# EAGLE design DUALLM13700VCA v2 (EAGLE 9.6.2)
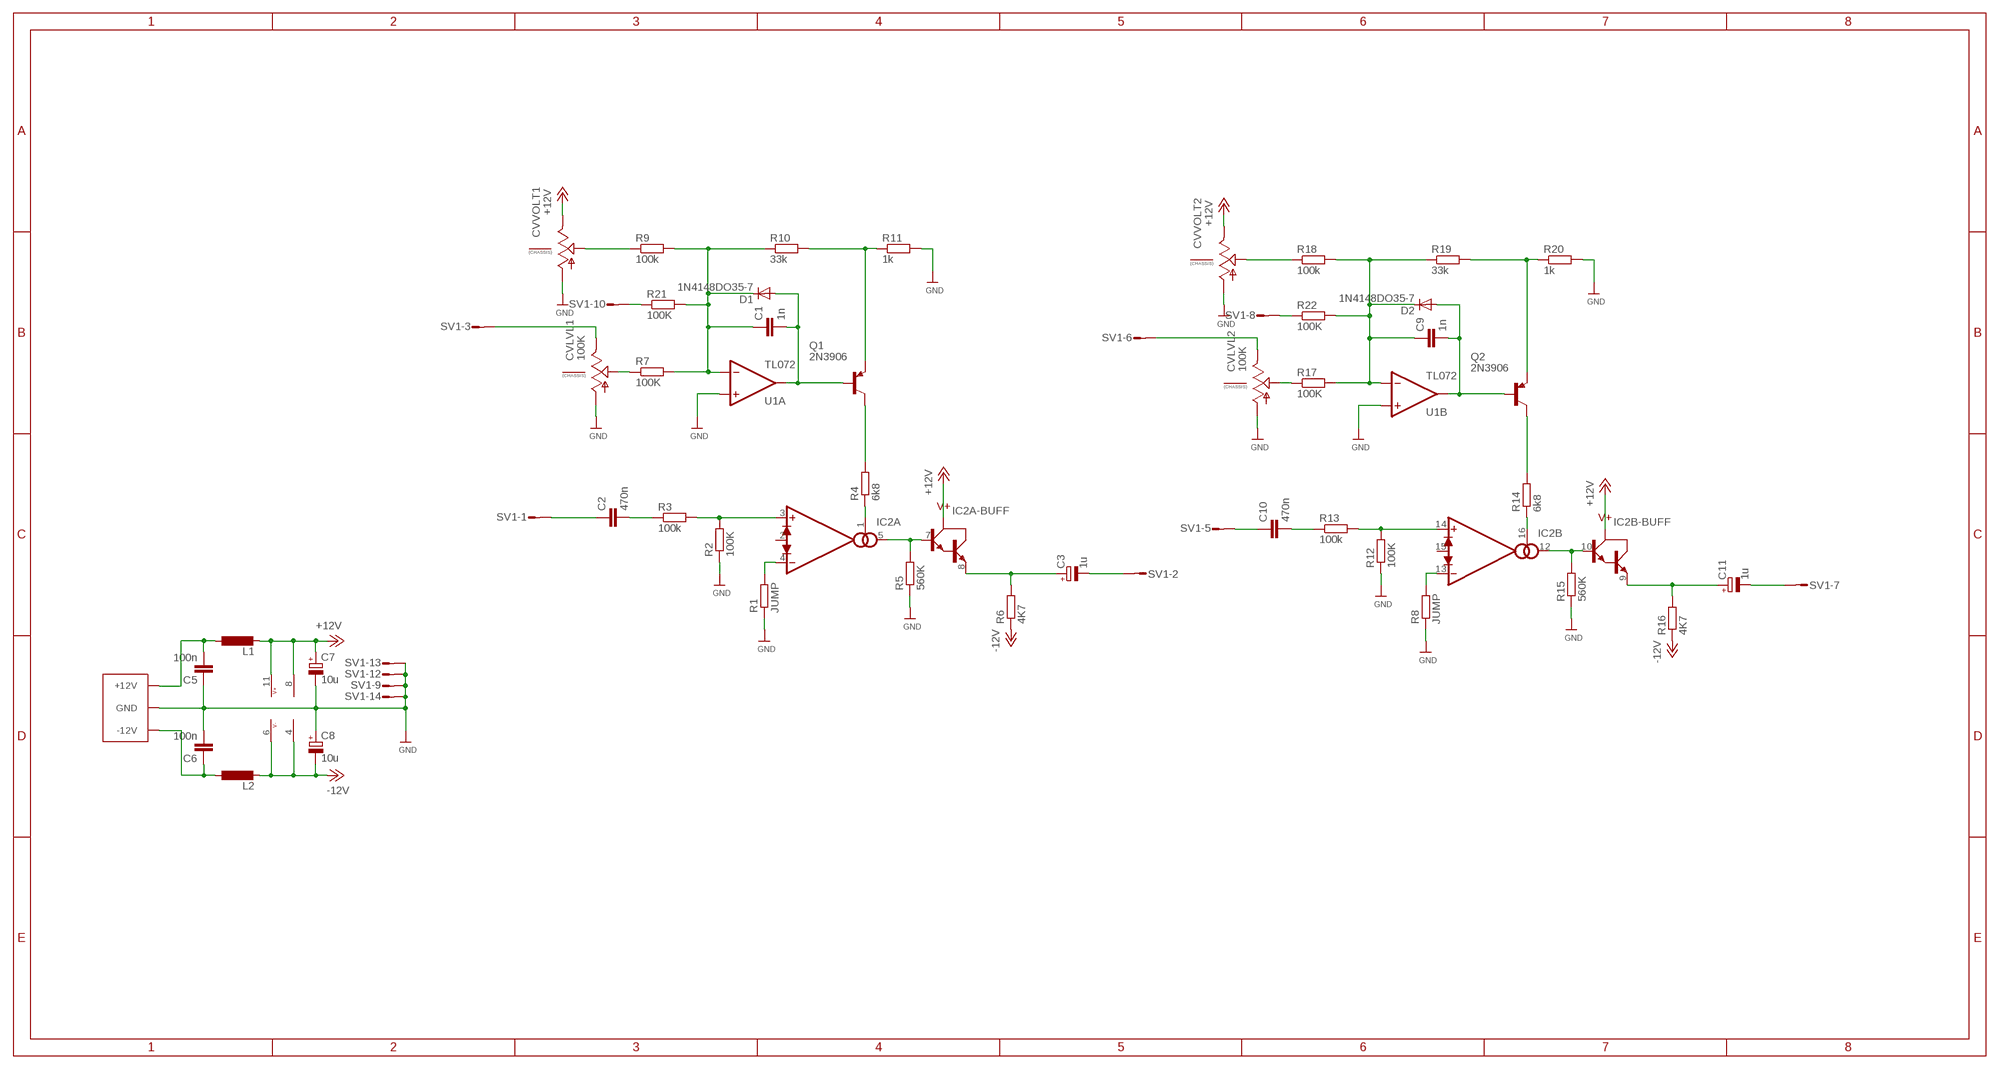
[diagram p0: schematic, sheet 1]

## Parts
C1  1n  C-EU050-025X075  [C050-025X075]
C2  470n  C-EU050-025X075  [C050-025X075]
C3  1u  CPOL-EUE2-4  [E2-4]
C4  EURO_POWER_LOCKSKINNY  [EURO_POWER_HEADER]
C5  100n  C-EU050-025X075  [C050-025X075]
C6  100n  C-EU050-025X075  [C050-025X075]
C7  10u  CPOL-EUE2-4  [E2-4]
C8  10u  CPOL-EUE2-4  [E2-4]
C9  1n  C-EU050-025X075  [C050-025X075]
C10  470n  C-EU050-025X075  [C050-025X075]
C11  1u  CPOL-EUE2-4  [E2-4]
CVLVL1  100K  9MM_SNAP-IN_POT_CHASSIS  [9MM_SNAP-IN_POT]
CVLVL2  100K  9MM_SNAP-IN_POT_CHASSIS  [9MM_SNAP-IN_POT]
CVVOLT1  9MM_SNAP-IN_POT_CHASSIS  [9MM_SNAP-IN_POT]
CVVOLT2  9MM_SNAP-IN_POT_CHASSIS  [9MM_SNAP-IN_POT]
D1  1N4148DO35-7  [DO35-7]
D2  1N4148DO35-7  [DO35-7]
IC2  LM13700N  [DIL16]
L1  L-EUIR-4  [IR-4]
L2  L-EUIR-4  [IR-4]
Q1  2N3906  [TO92]
Q2  2N3906  [TO92]
R1  JUMP  R-EU_0207/7  [0207/7]
R2  100K  R-EU_0207/7  [0207/7]
R3  100k  R-EU_0207/7  [0207/7]
R4  6k8  R-EU_0207/7  [0207/7]
R5  560K  R-EU_0207/7  [0207/7]
R6  4K7  R-EU_0207/7  [0207/7]
R7  100K  R-EU_0207/7  [0207/7]
R8  JUMP  R-EU_0207/7  [0207/7]
R9  100k  R-EU_0207/7  [0207/7]
R10  33k  R-EU_0207/7  [0207/7]
R11  1k  R-EU_0207/7  [0207/7]
R12  100K  R-EU_0207/7  [0207/7]
R13  100k  R-EU_0207/7  [0207/7]
R14  6k8  R-EU_0207/7  [0207/7]
R15  560K  R-EU_0207/7  [0207/7]
R16  4K7  R-EU_0207/7  [0207/7]
R17  100K  R-EU_0207/7  [0207/7]
R18  100k  R-EU_0207/7  [0207/7]
R19  33k  R-EU_0207/7  [0207/7]
R20  1k  R-EU_0207/7  [0207/7]
R21  100K  R-EU_0207/7  [0207/7]
R22  100K  R-EU_0207/7  [0207/7]
SV1  S14P  [S14P]
U1  TL072  [DIL08-SML]

## Nets
+12V: C7.+ CVVOLT1.3(E) CVVOLT2.3(E) IC2.11(PWR:V+) L1.2 U1.8(P:V+)
-12V: C8.- IC2.6(PWR:V-) L2.2 R6.1 R16.1 U1.4(P:V-)
GND: C4.3(GND) C4.4(GND) C4.5(GND) C4.6(GND) C4.7(GND) C4.8(GND) C5.1 C6.2 C7.- C8.+ CVLVL1.1(A) CVLVL2.1(A) CVVOLT1.1(A) CVVOLT2.1(A) R1.1 R2.1 R5.1 R8.1 R11.2 R12.1 R15.1 R20.2 SV1.9 SV1.12 SV1.13 SV1.14 U1.3(A:+IN) U1.5(B:+IN)
N$1: IC2.3(A:+IN) R2.2 R3.2
N$2: IC2.4(A:-IN) R1.2
N$3: CVVOLT1.2(S) R9.1
N$4: C2.2 R3.1
N$5: Q1.1(C) R4.2
N$6: IC2.1(A:BIAS) R4.1
N$7: C1.2 D1.A Q1.2(B) U1.1(A:OUT)
N$8: C1.1 D1.C R7.2 R9.2 R10.1 R21.2 U1.2(A:-IN)
N$9: Q1.3(E) R10.2 R11.1
N$10: CVLVL1.2(S) R7.1
N$11: CVLVL1.3(E) SV1.3
N$12: IC2.5(A:OUT) IC2.7(A-BUFF:IN) R5.2
N$13: C4.9(+12V) C4.10(+12V) C5.2 L1.1
N$14: C3.+ IC2.8(A-BUFF:OUT) R6.2
N$15: C3.- SV1.2
N$16: C4.1(-12V) C4.2(-12V) C6.1 L2.1
N$17: C2.1 SV1.1
N$18: IC2.14(B:+IN) R12.2 R13.2
N$19: Q2.1(C) R14.2
N$20: IC2.16(B:BIAS) R14.1
N$21: C9.2 D2.A Q2.2(B) U1.7(B:OUT)
N$22: C9.1 D2.C R17.2 R18.2 R19.1 R22.2 U1.6(B:-IN)
N$23: Q2.3(E) R19.2 R20.1
N$24: CVVOLT2.2(S) R18.1
N$25: CVLVL2.2(S) R17.1
N$26: CVLVL2.3(E) SV1.6
N$27: IC2.10(B-BUFF:IN) IC2.12(B:OUT) R15.2
N$28: C11.+ IC2.9(B-BUFF:OUT) R16.2
N$29: C11.- SV1.7
N$30: IC2.13(B:-IN) R8.2
N$31: C10.2 R13.1
N$32: C10.1 SV1.5
N$33: R21.1 SV1.10
N$34: R22.1 SV1.8
Unconnected: CVLVL1.CHASSIS1 CVLVL1.CHASSIS2 CVLVL2.CHASSIS1 CVLVL2.CHASSIS2 CVVOLT1.CHASSIS1 CVVOLT1.CHASSIS2 CVVOLT2.CHASSIS1 CVVOLT2.CHASSIS2 IC2.2(A:D-IN) IC2.15(B:D-IN) SV1.4 SV1.11

## Library data of the parts
C1 C2 C5 C6 C9 C10 = hexxxxrcl:C-EU: CAPACITOR, European symbol; SPICEPREFIX: C
C3 C7 C8 C11 = hexxxxrcl:CPOL-EU: POLARIZED CAPACITOR, European symbol; SPICEPREFIX: C
C4 = MusicThingModular:EURO_POWER_LOCK
CVLVL1 CVLVL2 CVVOLT1 CVVOLT2 = MusicThingModular:9MM_SNAP-IN_POT_CHASSIS: 9mm vertical snap-in pot, Alpha / Panasonic style, with a connection to the metal chassis for grounding
D1 D2 = diode:1N4148: DIODE high speed (Philips)
IC2 = skookumsynth_13700:LM13700: *UNVERIFIED* The LM13700 series consists of two current controlled transconductance amplifiers, each with differential inputs and a push-pull output. The two amplifiers share common supplies but otherwise operate independently. Linearizing diodes are provided at the inputs to reduce distortion and allow higher input levels. The result is a 10 dB signal-to-noise improvement referenced to 0.5 percent THD. High impedance buffers are provided which are especially designed to complement the dynamic range of the amplifiers. The output buffers of the LM13700 differ from those of the LM13600 in that their input bias currents (and hence their output DC levels) are independent of IABC. This may result in performance superior to that of the LM13600 in audio applications. MFG PART #s: DIL16: LM13700N/NOPB SO16:LM13700M/NOPB Datasheet: http://www.ti.com/lit/ds/symlink/lm13700.pdf
L1 L2 = rcl:L-EU: INDUCTOR, European symbol; SPICEPREFIX: L
Q1 Q2 = transistor-pnp:2N3906: PNP Transistor
R1-R22 = hexxxxrcl:R-EU_: RESISTOR, European symbol; SPICEPREFIX: R
SV1 = con-amp-mt:S14P: AMP MT CONNECTOR; OC_FARNELL: unknown; OC_NEWARK: unknown
U1 = MusicThingModular:TL072: Generic Dual Op Amp

## Net classes
0 default: width 0.61 mm

## Board
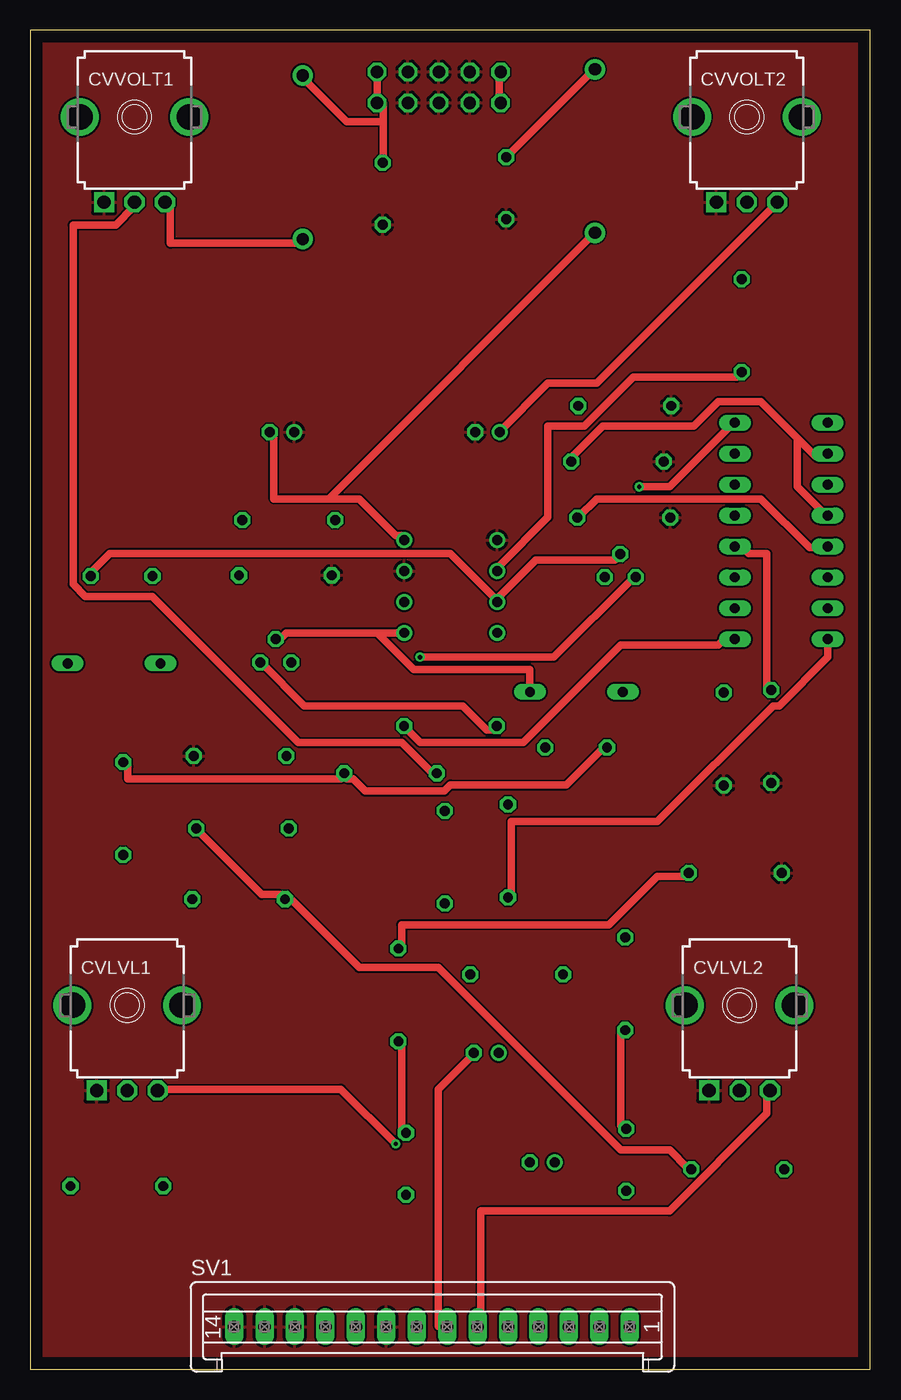
[diagram p1: board, top side]
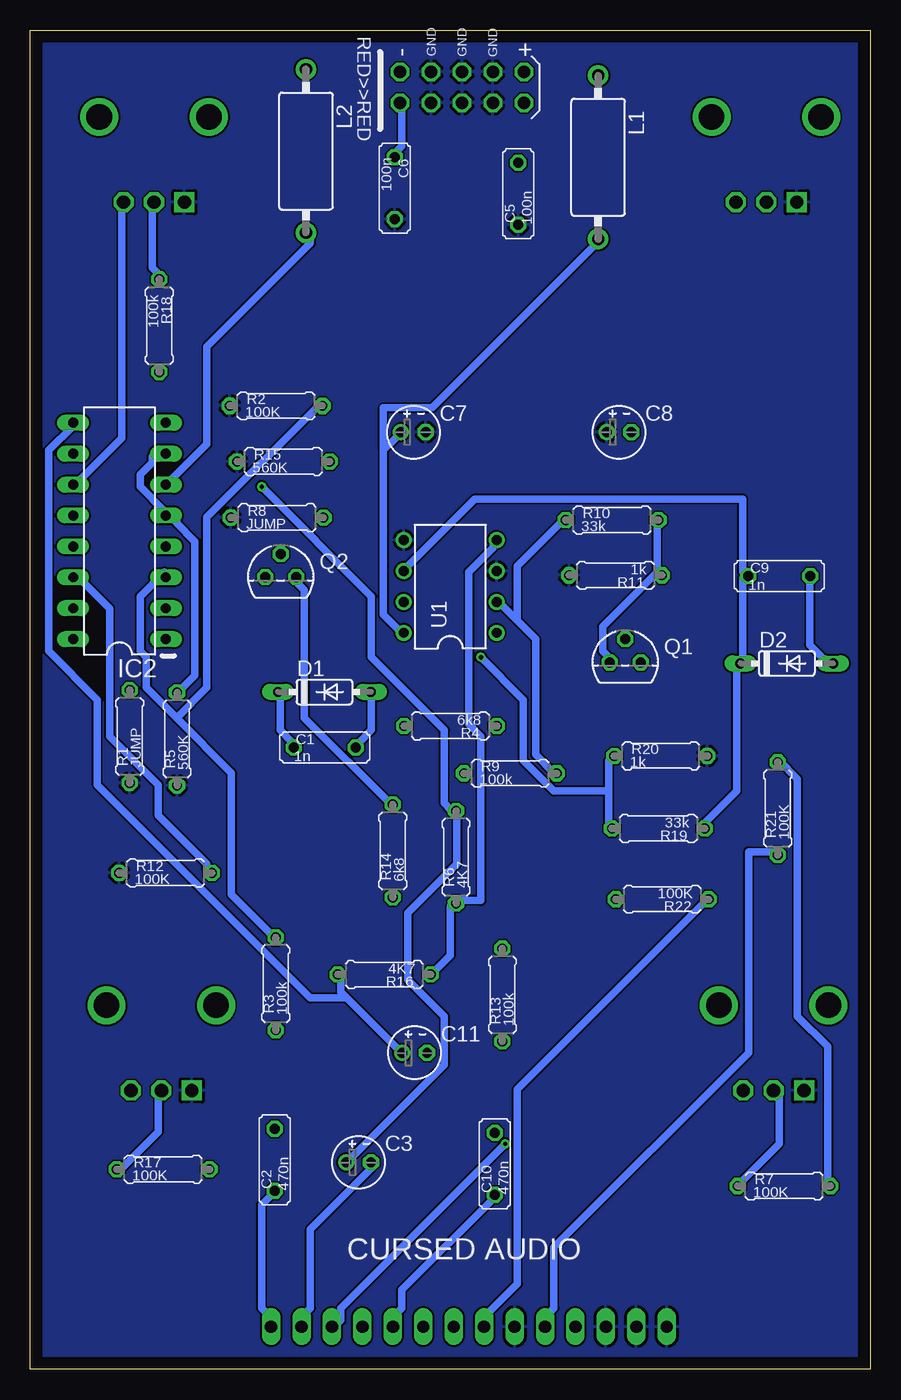
[diagram p2: board, bottom side, seen from below]

Size 69 x 110 mm. Coordinates in mm from the lower left corner, seen from the top.
Outline: 0,0 69,0 69,110 0,110 0,0
Copper layers (1*16): Top 0.035mm / dielectric 1.5mm / Bottom 0.035mm
Design rules "default": minimum track width 6mil, minimum drill 0.35mm, track to track 6mil, track to pad 6mil, pad to pad 6mil, via to via 6mil, smd to smd 6mil, copper to edge 40mil, drill to drill 6mil, minimum pad ring 10mil, minimum via ring 8mil, stop-mask expansion 4mil, vias tented up to drill 0mil, thermal gap 10mil

### Footprints (pad centres in the part's own frame; a part is rotated, then mirrored left to right if it is on the bottom)
C050-025X075 = drill 0.813 octagon: 1 -2.54,0; 2 2.54,0
E2-4 = drill 0.813 pad 1.27: + -1.016,0 | drill 0.813 pad 1.27 octagon: - 1.016,0
EURO_POWER_HEADER = drill 1.016 octagon: 1 -5.08,-1.27; 2 -5.08,1.27; 3 -2.54,-1.27; 4 -2.54,1.27; 5 0,-1.27; 6 0,1.27; 7 2.54,-1.27; 8 2.54,1.27; 9 5.08,-1.27; 10 5.08,1.27
9MM_SNAP-IN_POT = drill 1.1 square: 1 -2.5,-7 | drill 1.1 octagon: 2 0,-7; 3 2.5,-7 | drill 2.1 pad 2.794: CHASSIS1 -4.5,0; CHASSIS2 4.5,0
DO35-7 = drill 0.813 long: A 3.81,0; C -3.81,0
DIL16 = drill 0.813 long: 1 -8.89,-3.81; 2 -6.35,-3.81; 3 -3.81,-3.81; 4 -1.27,-3.81; 5 1.27,-3.81; 6 3.81,-3.81; 7 6.35,-3.81; 8 8.89,-3.81; 9 8.89,3.81; 10 6.35,3.81; 11 3.81,3.81; 12 1.27,3.81; 13 -1.27,3.81; 14 -3.81,3.81; 15 -6.35,3.81; 16 -8.89,3.81
IR-4 = drill 1 pad 1.676: 1 -6.705,0; 2 6.73,0
TO92 = drill 0.813 octagon: 1 1.27,0; 2 0,1.905; 3 -1.27,0
0207/7 = drill 0.813 octagon: 1 -3.81,0; 2 3.81,0
S14P = drill 1.016 long: 1 16.25,0; 2 13.75,0; 3 11.25,0; 4 8.75,0; 5 6.25,0; 6 3.75,0; 7 1.25,0; 8 -1.25,0; 9 -3.75,0; 10 -6.25,0; 11 -8.75,0; 12 -11.25,0; 13 -13.75,0; 14 -16.25,0
DIL08-SML = drill 0.813 pad 1.27: 1 -3.81,-3.81; 2 -1.27,-3.81; 3 1.27,-3.81; 4 3.81,-3.81; 5 3.81,3.81; 6 1.27,3.81; 7 -1.27,3.81; 8 -3.81,3.81

### Placement (x,y rotation side)
C1  44.82,51.07 0 bottom
C2  48.93,17.2 90 bottom
C3  42.04,16.99 0 bottom
C4  33.55,105.32 0 bottom
C5  28.93,96.58 90 bottom
C6  39.07,97.04 270 bottom
C7  37.55,76.99 0 bottom
C8  20.66,76.99 0 bottom
C9  7.49,65.15 0 bottom
C10  30.85,16.87 90 bottom
C11  37.44,25.99 0 bottom
CVLVL1  7.95,29.89 0 top
CVLVL2  58.25,29.89 0 top
CVVOLT1  8.55,102.89 0 top
CVVOLT2  58.85,102.89 0 top
D1  44.85,55.64 0 bottom
D2  6.87,57.99 0 bottom
IC2  61.68,68.87 90 bottom
L1  22.37,99.59 270 bottom
L2  46.37,100.1 270 bottom
Q1  20.14,58.07 0 bottom
Q2  48.44,65.07 0 bottom
R1  60.85,51.98 90 bottom
R2  48.82,79.15 0 bottom
R3  48.85,31.66 90 bottom
R4  34.5,52.85 180 bottom
R5  56.96,51.78 90 bottom
R6  34.04,42.06 90 bottom
R7  7.1,15.04 0 bottom
R8  48.74,69.96 0 bottom
R9  29.58,48.96 0 bottom
R10  21.22,69.77 0 bottom
R11  20.94,65.23 180 bottom
R12  57.9,40.77 0 bottom
R13  30.23,30.74 90 bottom
R14  39.23,42.58 90 bottom
R15  48.22,74.58 0 bottom
R16  39.94,32.42 180 bottom
R17  58.1,16.42 0 bottom
R18  58.42,85.74 270 bottom
R19  17.42,44.42 180 bottom
R20  17.22,50.39 0 bottom
R21  7.61,46.06 90 bottom
R22  17.1,38.61 180 bottom
SV1  32.98,3.48 0 top
U1  34.52,64.31 90 bottom

### Tracks (layer width: path | path; a pad name or v marks a point on that pad's centre or on a via)
+12V
  Top 0.61: CVVOLT1.3 11.5,95.5 11.5,92.5 22,92.5 L1.2 | CVVOLT2.3 61,95.5 46.5,81 42.5,81 38.5,77 C7.+
  Bottom 0.61: IC2.11 65,73 61.5,76.5 61.5,95.5 CVVOLT2.3 | 40,75.5 40,62 38.5,60.5 U1.8 | 40,75.5 39,76.5 C7.+ | 40,75.5 40,79 36,79 22.5,92.5 L1.2
-12V
  Top 0.61: 24.5,71.5 27,71.5 30,68.5 30.5,68.5 U1.4 | 24.5,71.5 20,71.5 20,76.5 C8.- | 24.5,71.5 L2.2
  Bottom 0.61: IC2.6 57.5,73 54.5,76 54.5,84 46,92.5 46,93 L2.2 | R16.1 36,32.5 34.5,34 34.5,38 R6.1 34,38.5 32,38.5 32,52 33,53 33,65.5 31,67.5 31,68 U1.4
GND
  pour Bottom: -1,114 71,114 71,-2 -1,-2
  pour Top: -2,114 73,114 73,-6 -2,-6
N$1
  Bottom 0.61: 57,53.5 59.5,56 59.5,58.5 60,59 60,63.5 58,65.5 IC2.3 | 57,53.5 52.5,49 52.5,39 49,35.5 R3.2 | 57,53.5 54.5,56 54.5,70 45.5,79 R2.2
N$2
  Top 0.61: R1.2 60.5,56 60.5,67 59,67 58.5,67.5 58,67.5 IC2.4
N$3
  Top 0.61: R9.1 33,49 30.5,51.5 22,51.5 10,63.5 4.5,63.5 3.5,64.5 3.5,94 7,94 8.5,95.5 CVVOLT1.2
N$4
  Top 0.61: R3.1 48.5,27.5 48.5,20 C2.2
N$5
  Top 0.61: Q1.1 19,58 22.5,54.5 35.5,54.5 37.5,52.5 38,52.5 R4.2
N$6
  Top 0.61: R4.1 31,52.5 32,51.5 40.5,51.5 48.5,59.5 56.5,59.5 57,60 57.5,60 IC2.1
N$7
  Top 0.61: U1.1 28.5,60.5 | 28.5,60.5 21,60.5 20.5,60 Q1.2 | 28.5,60.5 31.5,57.5 41,57.5 41,56 D1.A
  Bottom 0.61: C1.2 42,51.5 41,52.5 41,55.5 D1.A
N$8
  Top 0.61: C1.1 47,51 44,48 34.5,48 34,47.5 27.5,47.5 26.5,48.5 26,48.5 R9.2 25.5,48.5 8,48.5 8,49.5 R21.2
  Bottom 0.61: R7.2 3.5,15.5 3.5,26.5 6,29 6,48.5 7.5,50 R21.2 | C1.1 47.5,51.5 48.5,52.5 48.5,55.5 D1.C | 29,61.5 30.5,63 U1.2 | 29,61.5 27.5,60 27.5,50.5 26,49 R9.2 | 29,61.5 29,66 25.5,69.5 R10.1
N$9
  Bottom 0.61: 17.5,65.5 22,61 22,59 21.5,58.5 Q1.3 | 17.5,65.5 17.5,69.5 R10.2 | 17.5,65.5 R11.1
N$10
  Bottom 0.61: R7.1 10.5,15.5 7.5,18.5 7.5,22.5 CVLVL1.2
N$11  (via drill 0.35)
  Top 0.61: v30,18.5 25.5,23 10.5,23 CVLVL1.3
  Bottom 0.61: v30,18.5 43.5,5 43.5,4 44,3.5 SV1.3
N$12
  Bottom 0.61: R5.2 56.5,56 55.5,57 55.5,68 57,69.5 57,70 57.5,70.5 IC2.5 58,70.5 60,72.5 60,73.5 59,74.5 59,75 58,75 IC2.7
N$13
  Top 0.61: 29,102.5 29,104 28.5,104 C4.9 28.5,104.5 28.5,106.5 C4.10 | 29,102.5 29,99.5 C5.2 | 29,102.5 26,102.5 22.5,106 L1.1
N$14  (via drill 0.35)
  Top 0.61: v50,72.5 52.5,72.5 57.5,77.5 IC2.8
  Bottom 0.61: C3.+ 43,17 35,25 35,29 38,32 38,37.5 34,41.5 34,45.5 R6.2 34.5,46 35,46.5 35,52.5 41,58.5 41,63.5 v50,72.5
N$15
  Bottom 0.61: C3.- 41,16.5 46,11.5 46,5 46.5,4.5 46.5,3.5 SV1.2
N$16
  Top 0.61: C4.2 38.5,106.5 38.5,104.5 C4.1 | L2.1 46,106.5 39.5,100 C6.1
  Bottom 0.61: C6.1 39,100 38.5,100.5 38.5,104 C4.1
N$17
  Bottom 0.61: C2.1 49,14.5 50,13.5 50,5 49.5,4.5 49.5,3.5 SV1.1
N$18
  Top 0.61: R13.2 30.5,35 30.5,36.5 47.5,36.5 51.5,40.5 54,40.5 R12.2
  Bottom 0.61: IC2.14 65,65 62.5,62.5 62.5,52 58.5,48 58.5,45.5 54.5,41.5 54.5,41 R12.2
N$19
  Bottom 0.61: R14.2 39.5,46.5 46.5,53.5 46.5,64 47,64.5 47,65 Q2.1
N$20
  Top 0.61: R14.1 39.5,39 39.5,45 51.5,45 61,54.5 61.5,54.5 65.5,58.5 65.5,59.5 IC2.16
N$21
  Top 0.61: Q2.2 48,66.5 41.5,66.5 38.5,63.5 U1.7 38,63.5 34.5,67 6.5,67 5,65.5 C9.2
  Bottom 0.61: D2.A 3.5,58 5,59.5 5,65 C9.2
N$22
  Top 0.61: U1.6 38.5,66 42.5,70 42.5,77.5 45.5,77.5 49.5,81.5 58,81.5 R18.2 | R19.1 14,44 19,39 20.5,39 R22.2 21,38.5 21.5,38.5 27,33 33.5,33 48.5,18 52.5,18 54,16.5 R17.2
  Bottom 0.61: R19.1 13.5,44.5 13.5,45 11,47.5 11,57.5 D2.C 10.5,58 10.5,65 C9.1 10.5,65.5 10.5,71.5 32.5,71.5 38,66 U1.6
N$23  (via drill 0.35)
  Top 0.61: v32,58.5 43,58.5 49.5,65 Q2.3
  Bottom 0.61: 21.5,47.5 21.5,44.5 R19.2 | 21.5,47.5 21.5,50 R20.1 | v32,58.5 28.5,55 28.5,50 26,47.5 21.5,47.5
N$24
  Bottom 0.61: R18.1 58.5,90 59,90.5 59,95.5 CVVOLT2.2
N$25
  Bottom 0.61: R17.1 61.5,16.5 58.5,19.5 58.5,22.5 CVLVL2.2
N$26
  Top 0.61: SV1.6 37,3.5 37,13 52.5,13 60.5,21 60.5,22.5 CVLVL2.3
N$27
  Top 0.61: 63,76.5 64.5,75 65,75 IC2.10 | 63,76.5 60,79.5 56.5,79.5 54.5,77.5 47,77.5 44.5,75 R15.2 | 63,76.5 63,72.5 65,70.5 IC2.12
N$28
  Bottom 0.61: 43,30.5 43.5,31 43.5,32 R16.2 | 43,30.5 38.5,26 C11.+ | 43,30.5 46,30.5 63.5,48 63.5,55 67.5,59 67.5,75.5 65.5,77.5 IC2.9
N$29
  Top 0.61: C11.- 36,25.5 33.5,23 33.5,3.5 34,3.5 SV1.7
N$30
  Top 0.61: R8.2 45,70 46.5,71.5 60,71.5 64,67.5 65,67.5 IC2.13
N$31
  Top 0.61: C10.2 30.5,19.5 30.5,26.5 R13.1
N$32
  Bottom 0.61: C10.1 31,14 38.5,6.5 38.5,5 39,4.5 39,3.5 SV1.5
N$33
  Bottom 0.61: R21.1 8,42.5 10,42.5 10,26 26,10 26,5 26.5,4.5 26.5,3.5 SV1.10
N$34
  Bottom 0.61: R22.1 13.5,38.5 29,23 29,7 31.5,4.5 31.5,3.5 SV1.8

### Text on the board
bPlace: CURSED AUDIO